# EAGLE design 1u-diodeor (EAGLE 7.7.0)
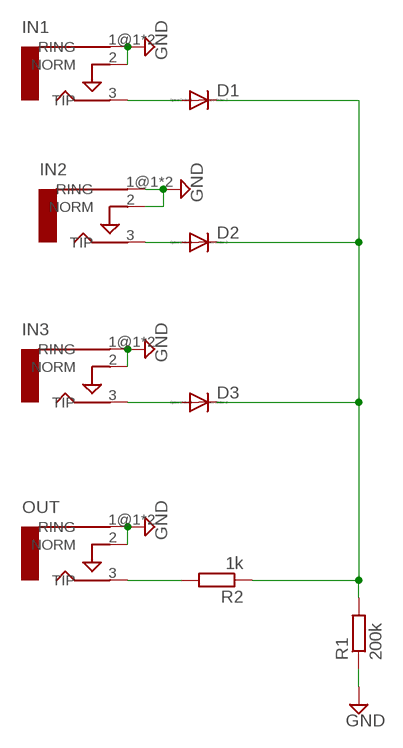
[diagram p0: schematic, sheet 1]

## Parts
D1  DIODE-SOD123  [SOD123]
D2  DIODE-SOD123  [SOD123]
D3  DIODE-SOD123  [SOD123]
IN1  AUDIO-JACKERTHENVAR  [ERTHENVAR-JACK]
IN2  AUDIO-JACKERTHENVAR  [ERTHENVAR-JACK]
IN3  AUDIO-JACKERTHENVAR  [ERTHENVAR-JACK]
OUT  AUDIO-JACKERTHENVAR  [ERTHENVAR-JACK]
R1  200k  R-EU_R0805  [R0805]
R2  1k  R-EU_R0805  [R0805]

## Nets
GND: IN1.1@1(RING) IN1.1@2(RING) IN1.2(NORM) IN2.1@1(RING) IN2.1@2(RING) IN2.2(NORM) IN3.1@1(RING) IN3.1@2(RING) IN3.2(NORM) OUT.1@1(RING) OUT.1@2(RING) OUT.2(NORM) R1.1
N$1: D1.A IN1.3(TIP)
N$2: D2.A IN2.3(TIP)
N$3: D3.A IN3.3(TIP)
N$4: D1.C D2.C D3.C R1.2 R2.1
N$9: OUT.3(TIP) R2.2

## Library data of the parts
D1-D3 = diode:DIODE-: DIODE
IN1-IN3 OUT = erthenvar:AUDIO-JACK: Switching Mono 3.5mm Audio Jack from Erthenvar.
R1 R2 = rcl:R-EU_: RESISTOR, European symbol

## Board
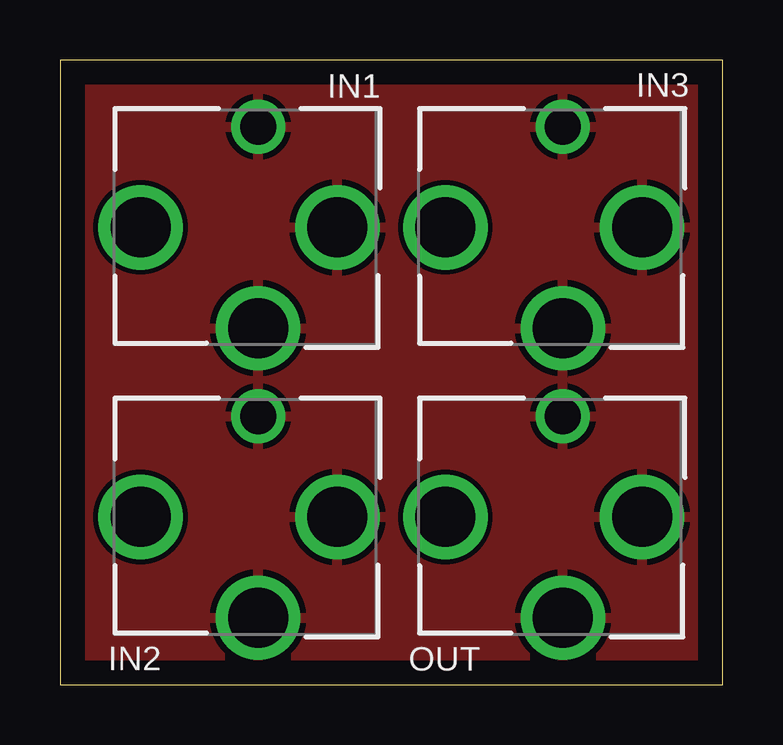
[diagram p1: board, top side]
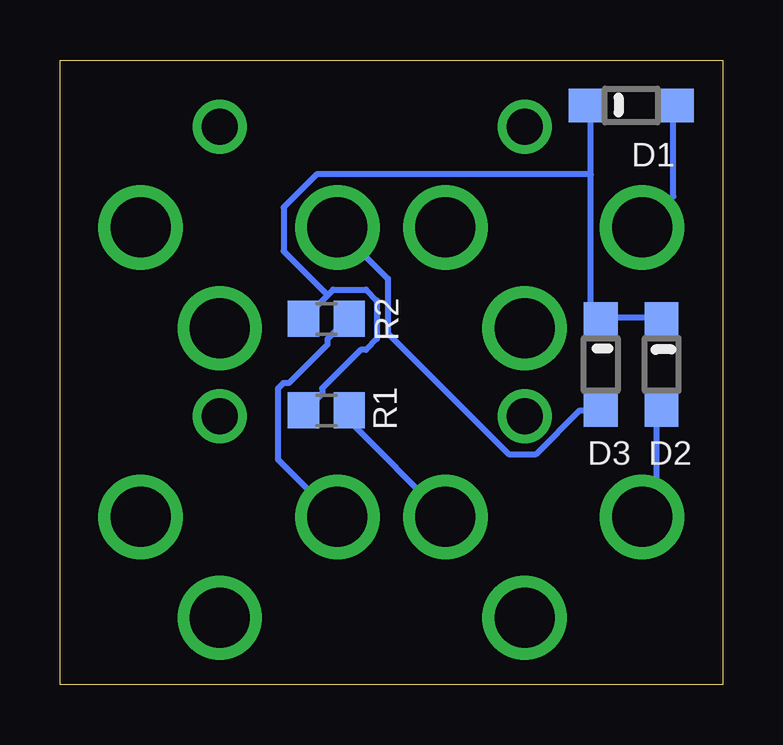
[diagram p2: board, bottom side, seen from below]

Size 27.61 x 26.02 mm. Coordinates in mm from the lower left corner, seen from the top.
Outline: 0,0 27.61,0 27.61,26.02 0,26.02 0,0
Copper layers (1*16): Top 0.035mm / dielectric 1.5mm / Bottom 0.035mm
Design rules "default": minimum track width 10mil, minimum drill 24mil, track to track 8mil, track to pad 8mil, pad to pad 8mil, via to via 8mil, smd to smd 8mil, copper to edge 40mil, drill to drill 8mil, minimum pad ring 10mil, minimum via ring 8mil, stop-mask expansion 4mil, vias tented up to drill 0mil, thermal gap 10mil

### Footprints (pad centres in the part's own frame; a part is rotated, then mirrored left to right if it is on the bottom)
SOD123 = smd 1.4 x 1.4: A 1.9,0; C -1.9,0
ERTHENVAR-JACK = drill 2.5: 1@1 -4.2,0; 2 0,-3.3; 3 0,4.9 | drill 1.5: 1@2 4.2,0
R0805 = smd 1.3 x 1.5: 1 -0.95,0; 2 0.95,0

### Placement (x,y rotation side)
D1  3.81,24.13 0 bottom
D2  2.54,13.34 270 bottom
D3  5.08,13.34 270 bottom
IN1  8.26,19.05 90 top
IN2  8.26,6.99 90 top
IN3  20.95,19.05 90 top
OUT  20.95,6.99 90 top
R1  16.51,11.43 180 bottom
R2  16.51,15.24 0 bottom

### Tracks (layer width: path | path; a pad name or v marks a point on that pad's centre or on a via)
GND
  Bottom 0.254: R1.1 15.54,11.43 15.54,10.97 11.66,7.09 IN2.2
  pour Top: 0,26.67 27.94,26.67 27.94,0 0,0
N$1
  Bottom 0.254: D1.A 2.06,24 2.06,20.34 3.2,19.2 IN1.3
N$2
  Bottom 0.254: D2.A 2.74,11.43 2.74,7.54 3.2,7.09 IN2.3
N$3
  Bottom 0.254: D3.A 5.26,11.43 5.94,11.43 7.77,9.6 8.91,9.6 13.95,14.63 13.95,16.92 16,18.97 IN3.3
N$4
  Bottom 0.254: 16.46,16.23 17.37,15.32 R2.1 | 16.46,16.23 16.23,16.46 14.86,16.46 14.4,16 14.4,14.4 14.86,13.95 15.09,13.95 16.69,12.34 16.69,12.12 17.37,11.43 R1.2 | D2.C 2.74,15.32 5.03,15.32 D3.C 5.26,15.32 5.49,15.54 5.49,21.26 | 5.49,21.26 5.49,24 D1.C | 16.46,16.23 18.29,18.06 18.29,19.89 16.92,21.26 5.49,21.26
N$9
  Bottom 0.254: R2.2 15.77,15.09 16.46,14.4 16.46,14.17 18.06,12.57 18.29,12.57 18.52,12.34 18.52,9.37 16.23,7.09 OUT.3